# Altium schematic sheet Isolation.SchDoc: Isolation For Geec Power Electronics
size A4; Author: Conor Farrell; SheetNumber: 3; SheetTotal: 6
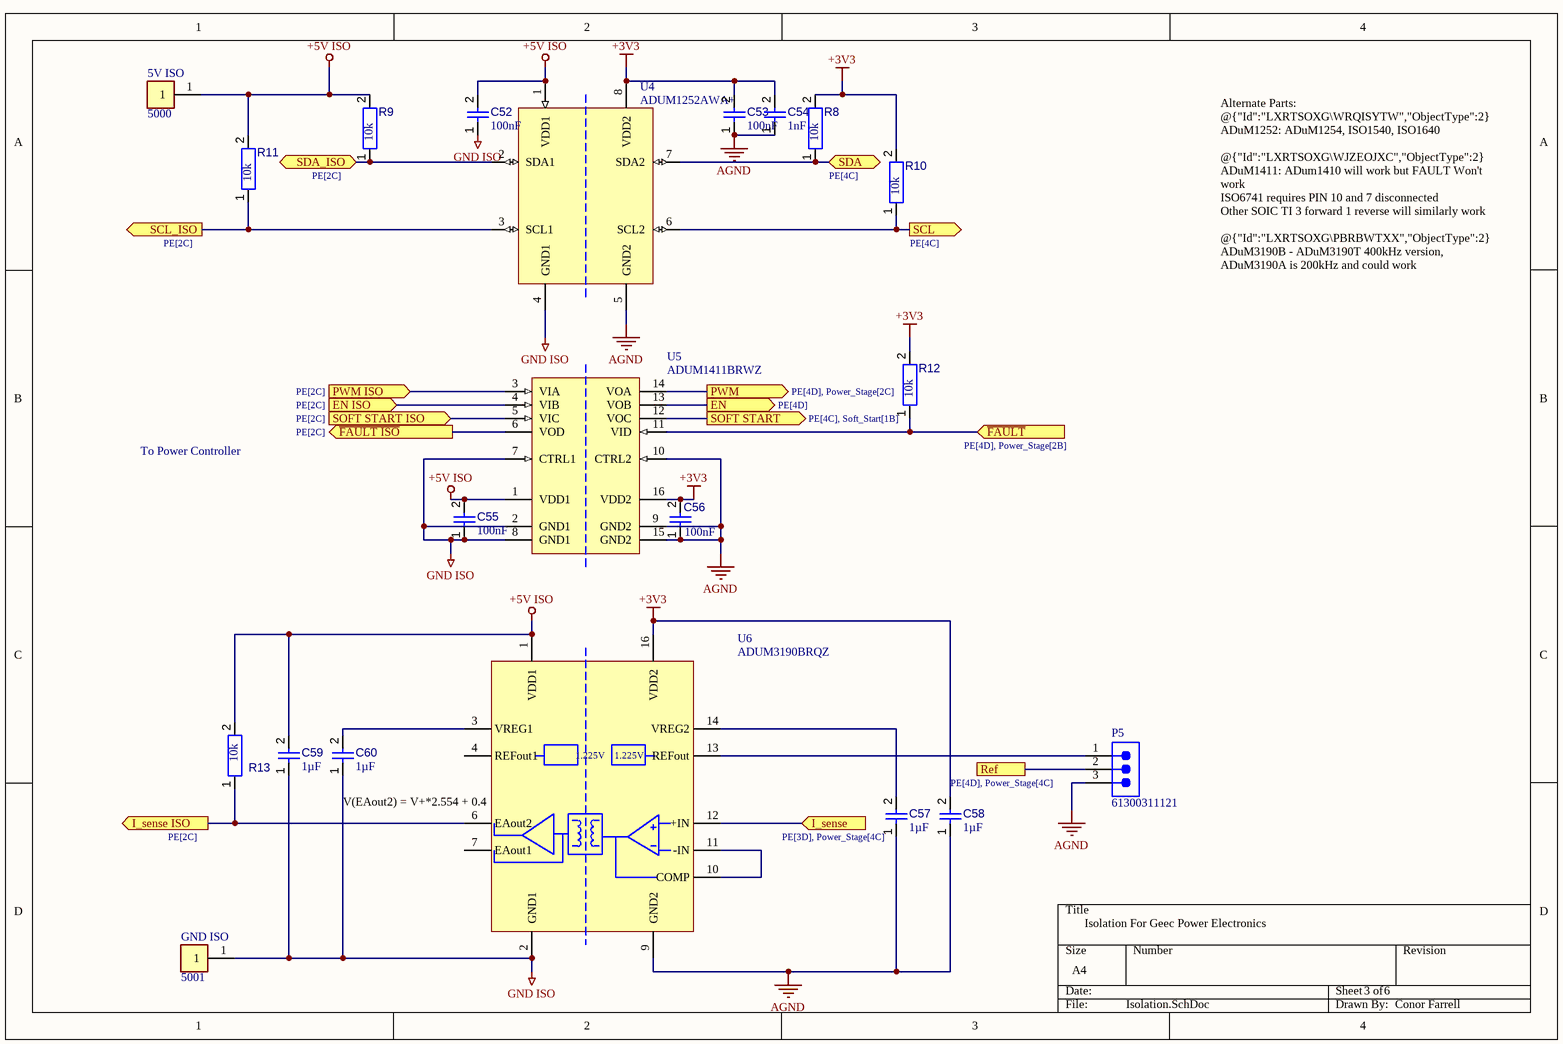
[diagram p0: Isolation.SchDoc]

## Parts
5V_ISO  5000  [FP-5000-MFG]
C52  value 100nF  [CAPC3216X06N]  (hidden comment: C1206C104K1RACTU)
C53  value 100nF  [CAPC3216X06N]  (hidden comment: C1206C104K1RACTU)
C54  value 1nF  [FP-CL31-IPC_A]  (hidden comment: CL31B102KGFNNNE)
C55  value 100nF  [CAPC3216X06N]  (hidden comment: C1206C104K1RACTU)
C56  value 100nF  [CAPC3216X06N]  (hidden comment: C1206C104K1RACTU)
C57  value 1µF  [CAPC3216X180X20ML20]  (hidden comment: CL31B105KBHNNNE)
C58  value 1µF  [CAPC3216X180X20ML20]  (hidden comment: CL31B105KBHNNNE)
C59  value 1µF  [CAPC3216X180X20ML20]  (hidden comment: CL31B105KBHNNNE)
C60  value 1µF  [CAPC3216X180X20ML20]  (hidden comment: CL31B105KBHNNNE)
GND_ISO  5001  [FP-5001-MFG]
P5  61300311121  [61300311121]
R8  value 10k  [RESC3216X60X45ML15T20]  (hidden comment: 1206W4F1002T5E)
R9  value 10k  [RESC3216X60X45ML15T20]  (hidden comment: 1206W4F1002T5E)
R10  value 10k  [RESC3216X60X45ML15T20]  (hidden comment: 1206W4F1002T5E)
R11  value 10k  [RESC3216X60X45ML15T20]  (hidden comment: 1206W4F1002T5E)
R12  value 10k  [RESC3216X60X45ML15T20]  (hidden comment: 1206W4F1002T5E)
R13  value 10k  [RESC3216X60X45ML15T20]  (hidden comment: 1206W4F1002T5E)
U4  ADUM1252AWA+  [SOIC127P1030X265-8N]
U5  ADUM1411BRWZ  [ADI-RW-16_M]
U6  ADUM3190BRQZ  [SOP64P600X175-16N]

## Ports
EN (out, see PE[4D]), EN ISO (in, see PE[2C]), I_sense (in, see PE[3D], Power_Stage[4C]), I_sense ISO (out, see PE[2C]), PWM (out, see PE[4D], Power_Stage[2C]), PWM ISO (in, see PE[2C]), Ref (see PE[4D], Power_Stage[4C]), SCL (out, see PE[4C]), SCL_ISO (out, see PE[2C]), SDA (bidir, see PE[4C]), SDA_ISO (bidir, see PE[2C]), SOFT START (out, see PE[4C], Soft_Start[1B]), SOFT START ISO (in, see PE[2C]), ~{FAULT ISO} (out, see PE[2C]), ~{FAULT} (in, see PE[4D], Power_Stage[2B])

## Nets
+3V3: C53.2 C54.2 C56.2 C58.2 R8.2 R10.2 R12.2 U4.8(VDD2) U5.16(VDD2) U6.16(VDD2)
+5V ISO: 5V_ISO.1 C52.2 C55.2 C59.2 R9.2 R11.2 R13.2 U4.1(VDD1) U5.1(VDD1) U6.1(VDD1)
AGND: C53.1 C54.1 C56.1 C57.1 C58.1 P5.3 U4.5(GND2) U5.9(GND2) U5.10(CTRL2) U5.15(GND2) U6.9(GND2)
GND ISO: C52.1 C55.1 C59.1 C60.1 GND_ISO.1 U4.4(GND1) U5.2(GND1) U5.7(CTRL1) U5.8(GND1) U6.2(GND1)
~{FAULT}: R12.1 U5.11(VID) ; port ~{FAULT}
~{FAULT ISO}: U5.6(VOD) ; port ~{FAULT ISO}
EN: U5.13(VOB) ; port EN
EN ISO: U5.4(VIB) ; port EN ISO
I_sense: U6.12(+IN) ; port I_sense
I_sense ISO: R13.1 U6.6(EAout2) ; port I_sense ISO
PWM: U5.14(VOA) ; port PWM
PWM ISO: U5.3(VIA) ; port PWM ISO
Ref: P5.2 ; port Ref
SCL: R10.1 U4.6(SCL2) ; port SCL
SCL_ISO: R11.1 U4.3(SCL1) ; port SCL_ISO
SDA: R8.1 U4.7(SDA2) ; port SDA
SDA_ISO: R9.1 U4.2(SDA1) ; port SDA_ISO
SOFT START: U5.12(VOC) ; port SOFT START
SOFT START ISO: U5.5(VIC) ; port SOFT START ISO
NetC57_2: C57.2 U6.14(VREG2)
NetC60_2: C60.2 U6.3(VREG1)
NetP5_1: P5.1 U6.13(REFout)
NetU6_10: U6.10(COMP) U6.11(-IN)

Not connected (* = marked no-connect by the designer): U6 4(REFout1) 7(EAout1)

## Notes on the sheet
- Alternate Parts:
  @{"Id":"LXRTSOXG\WRQISYTW","ObjectType":2} ADuM1252: ADuM1254, ISO1540, ISO1640
  @{"Id":"LXRTSOXG\WJZEOJXC","ObjectType":2} ADuM1411: ADum1410 will work but FAULT Won't work
  ISO6741 requires PIN 10 and 7 disconnected
  Other SOIC TI 3 forward 1 reverse will similarly work
  @{"Id":"LXRTSOXG\PBRBWTXX","ObjectType":2} ADuM3190B - ADuM3190T 400kHz version, ADuM3190A is 200kHz and could work
- To Power Controller
- (near U6) V(EAout2) = V+*2.554 + 0.4
- (in symbol CMP-014-00002-3) 1.225V

## Library data of the parts
5V_ISO = CMP-00030-00004-2: Cable Wrap, 1/2 Inch, Polyethylene, Natural, 50 Ft, Spirap Series; Hole Diameter: 1.6mm; Mounting Technology: PCB, Through Hole; Color: Red
C52 C53 C55 C56 = CMP-001-00083-1: Ceramic Capacitor, Multilayer, Ceramic, 200V, 10% +Tol, 10% -Tol, X7R, 15% TC, 0.01uF, 1206; Voltage Rating: 100V; Case/Package: 1206; Pins: 2; Mounting Technology: Surface Mount; Min Operating Temperature: -55°C; Max Operating Temperature: 125°C; Tolerance: 10%
C54 = CMP-001-00090-1: Ceramic Capacitor, Multilayer, Ceramic, 500V, 10% +Tol, 10% -Tol, X7R, +-15% TC, 1nF, Surface Mount, 1206 inch; Min Operating Temperature: -55°C; Mounting Technology: Surface Mount; Tolerance: 10%; Max Operating Temperature: 125°C; Case/Package: 1206; Voltage Rating: 500V
C57-C60 = CMP-001-00086-1: Ceramic Capacitor, Multilayer, Ceramic, 50V, 10% +Tol, 10% -Tol, X7R, +-15% TC, 1uF, Surface Mount, 1206 inch; Mounting Technology: Surface Mount; JLCPN: C1848; Max Operating Temperature: 125°C; Min Operating Temperature: -55°C; Case/Package: 1206; Tolerance: 10%; Voltage Rating: 50V
GND_ISO = CMP-00030-00001-2: Test Point, Mini, Thm, Pc, .300 L, .100 Od, Heat Resistant Nylon 46, Black; Hole Diameter: 1.6mm; Color: Black; Pins: 1; Mounting Technology: PCB, Through Hole
P5 = CMP-002-00212-1: WR-PHD Pin Header, THT, Vertical, pitch 2.54mm, 1 Row, 3P; Manufacturer: Wurth Elektronik; Contact Resistance: 20mOhm; Withstanding Voltage: 500V; Rated Current: 3A; Working Voltage: 250V; Pin Count: 3; Gender: Pin Header; Pins: 3; Number of Rows: 1; Packaging: Bag; Pitch: 2.54mm; Match Code: WR-PHD; ComponentLink1URL: https://www.we-online.com/redexpert/article/61300311121?ad; ComponentLink2URL: https://www.we-online.com/redexpert/spec/61300311121?ad; Orientation: Vertical; Operating Temperature Min: -40°C; Mount: Through Hole; Operating Temperature Max: 105°C; Source: WR-PHD.SchLib; Manufacturer Part Number: 61300311121; Design Item ID: 61300311121; Category: Board-to-Board Connectors; ComponentLink1Description: Website Link; Component Type: Standard; ComponentLink2Description: Datasheet Link
R8-R13 = CMP-009-00184-2: Res Thick Film 1206 10K Ohm 1% 0.25W(1/4W) ±100ppm/C Pad SMD T/R; JLCPN: C17902; Case/Package: 1206
U4 = CMP-016-00010-2: Ultra-Low Power, Bidirectional I2C Isolator with Extended VDD, Idle-Bus Hot-Swap and Low VOL; JLCPN: C44197888; MPN: ADUM1252AWA+
U5 = CMP-015-00009-2: Digital Isolator CMOS 4-CH 10Mbps 16-Pin SOIC W Tube / DGTL ISO 3.75KV GEN PURP 16SOIC; Min Supply Voltage: 2.7V; Max Supply Voltage: 5.5V; Pins: 16; Max Operating Temperature: 105°C; Case/Package: SOIC; Min Operating Temperature: -40°C; JLCPN: C660417
U6 = CMP-014-00002-3: High Stability Isolated Error Amplifier; pin to pad: 2>2+8 9>9+15; Max Supply Voltage: 20V; Min Supply Voltage: 3V; Max Operating Temperature: 85°C; Min Operating Temperature: -40°C; MPN: ADUM3190BRQZ; Case/Package: QSOP; Pins: 16; Mounting Technology: Surface Mount